# Altium schematic sheet SMT_SW_PTS_820_Button.SchDoc
size A4
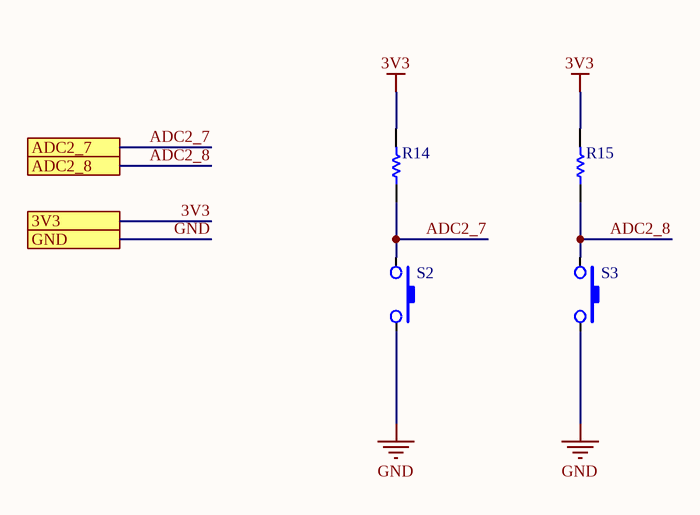
[diagram p0: SMT_SW_PTS_820_Button.SchDoc]

## Parts
R14  RK73B2ATTD103J  [RESC2013X60X30NL20T20]  (value not drawn)
R15  RK73B2ATTD103J  [RESC2013X60X30NL20T20]  (value not drawn)
S2  PTS820J25MSMTRLFS  [SMT_SW_PTS_820]  (value not drawn)
S3  PTS820J25MSMTRLFS  [SMT_SW_PTS_820]  (value not drawn)

## Ports
3V3, ADC2_7, ADC2_8, GND

## Nets
3V3: R14.2 R15.2 ; port 3V3
GND: S2.2 S3.2 ; port GND
ADC2_7: R14.1 S2.1 ; port ADC2_7
ADC2_8: R15.1 S3.1 ; port ADC2_8

## Library data of the parts
R14 R15 = CMP-2001-04657-1: 10 kOhms ±5% 0.25W, 1/4W Chip Resistor 0805 (2012 Metric) Automotive AEC-Q200, Moisture Resistant Thick Film; Manufacturer: KOA Speer; Part Number: RK73B2ATTD103J
S2 S3 = PTS820J25MSMTRLFS: Tactile Switch SPST-NO Top Actuated Surface Moun